# Altium schematic sheet SystemStatusBoard.SchDoc
size C
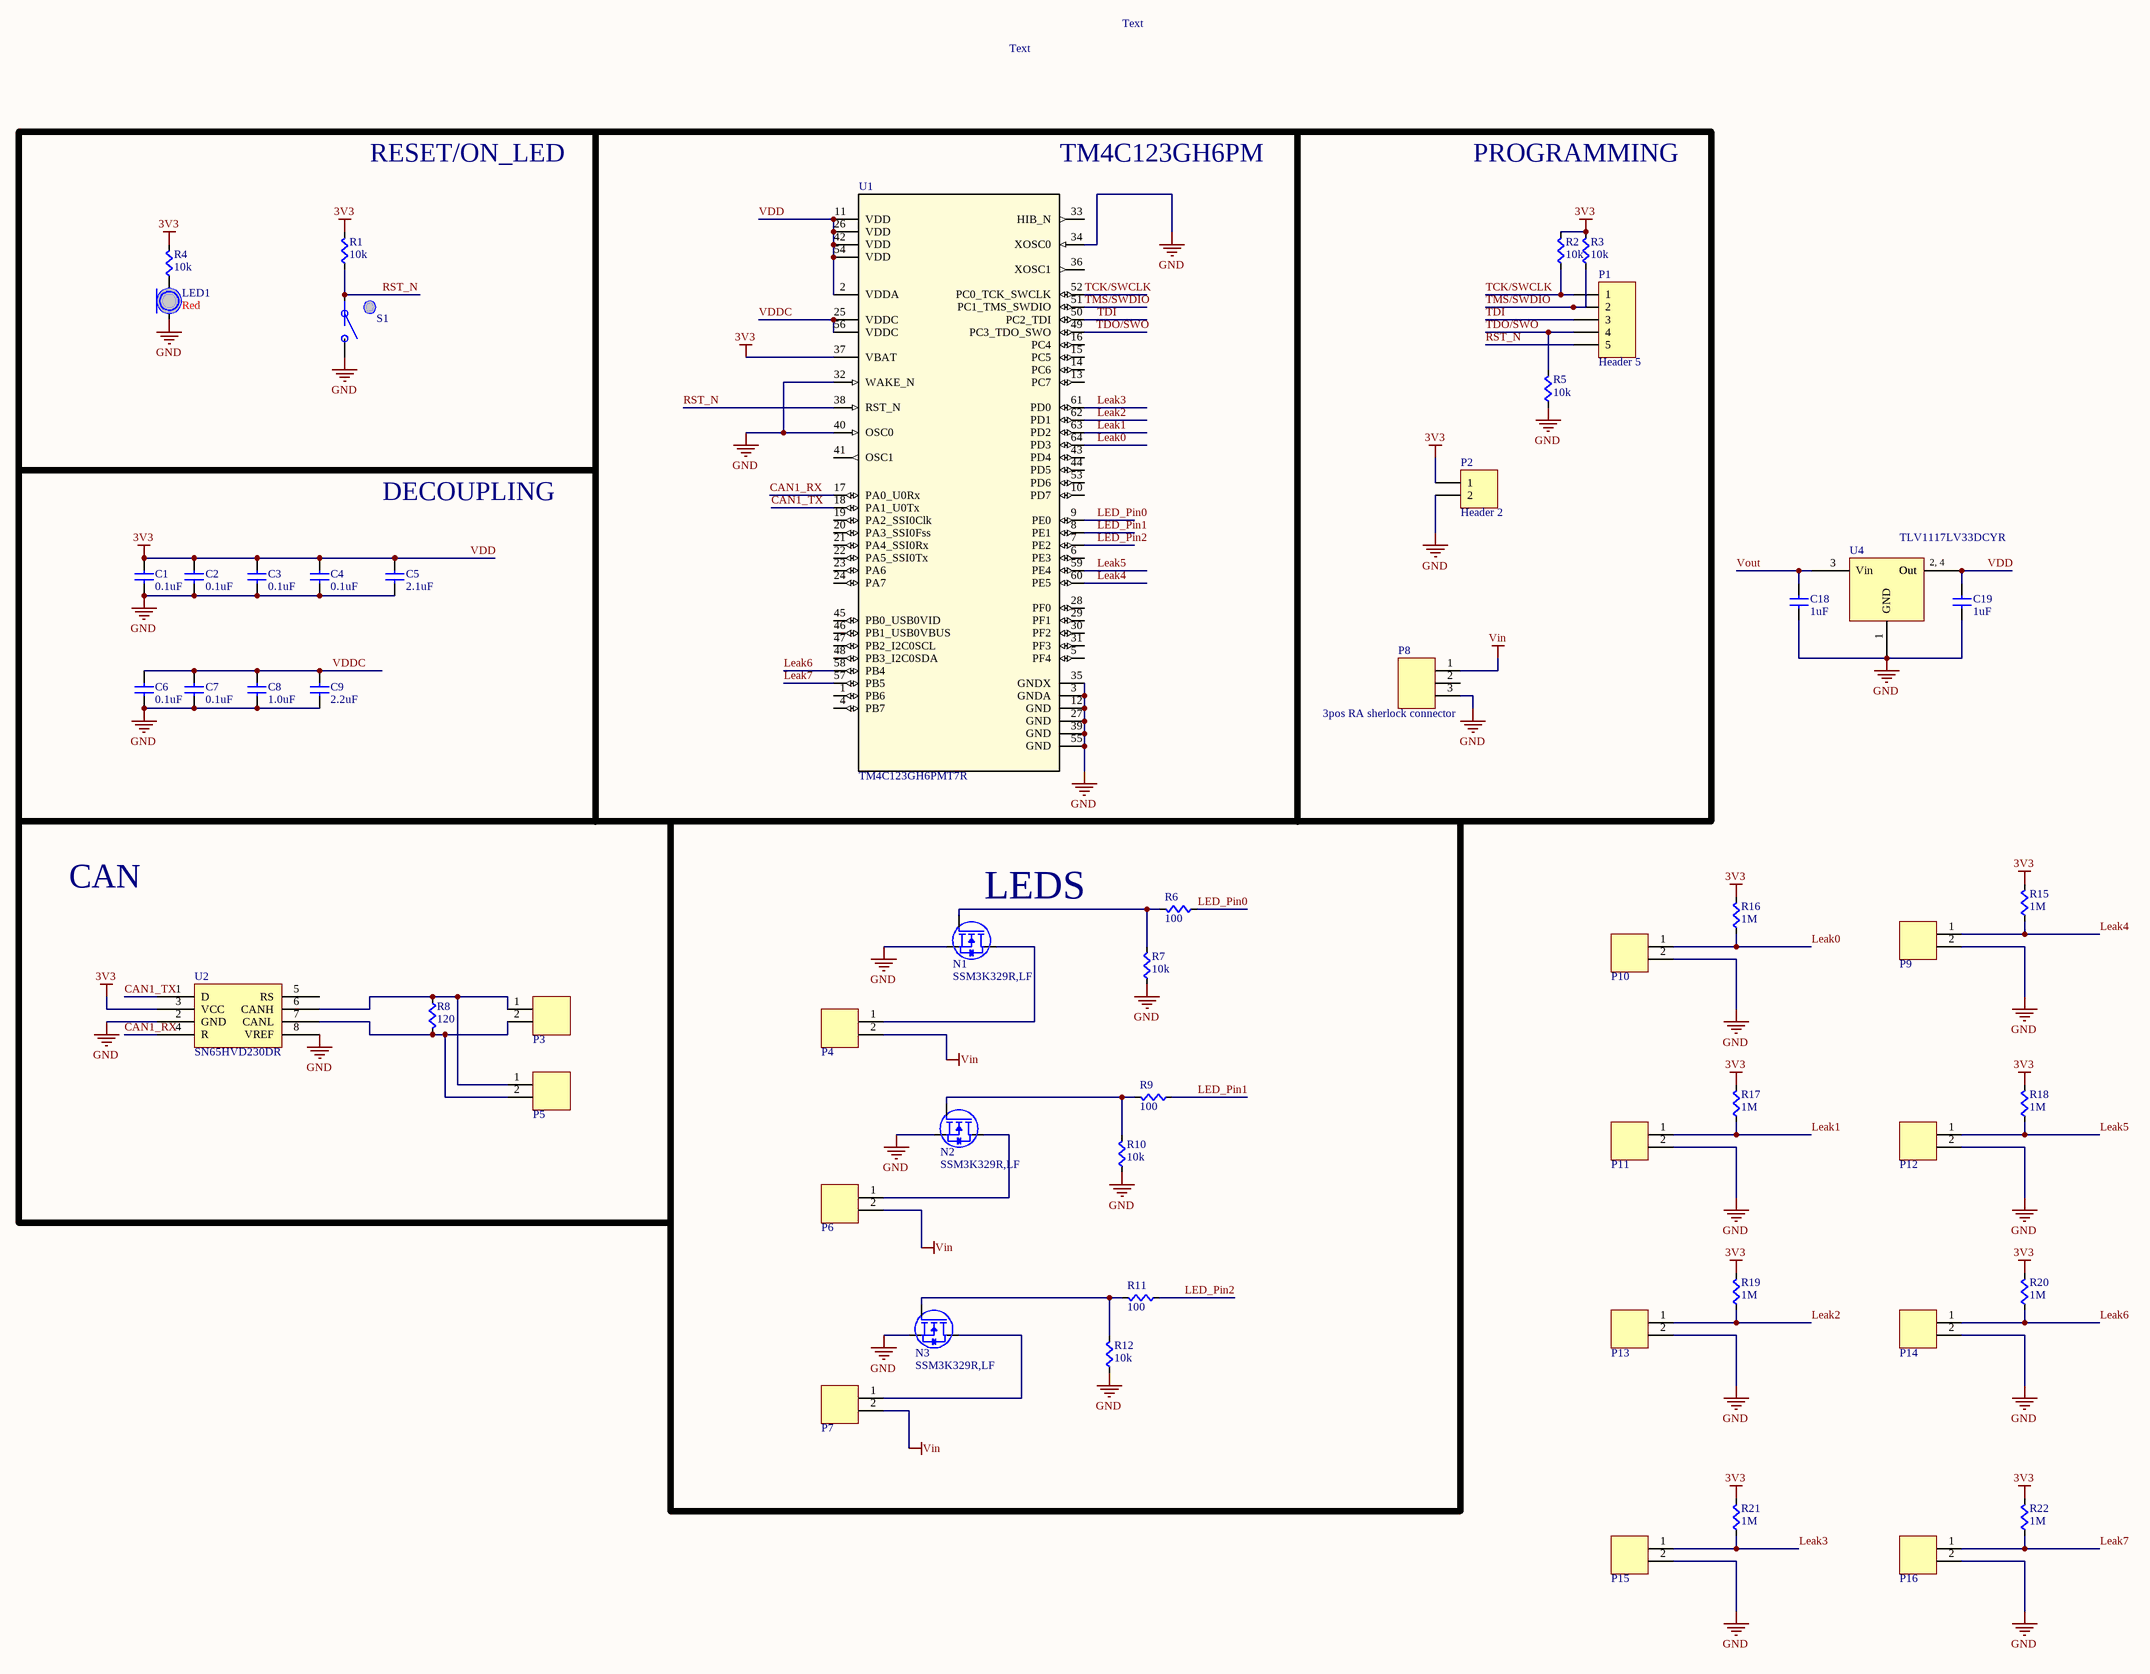
[diagram p0: SystemStatusBoard.SchDoc]

## Parts
C1  value 0.1uF  [CAPC0603]  (hidden comment: Cap)
C2  value 0.1uF  [CAPC0603]  (hidden comment: Cap)
C3  value 0.1uF  [CAPC0603]  (hidden comment: Cap)
C4  value 0.1uF  [CAPC0603]  (hidden comment: Cap)
C5  value 2.1uF  [CAPC0603]  (hidden comment: Cap)
C6  value 0.1uF  [CAPC0603]  (hidden comment: Cap)
C7  value 0.1uF  [CAPC0603]  (hidden comment: Cap)
C8  value 1.0uF  [CAPC0603]  (hidden comment: Cap)
C9  value 2.2uF  [CAPC0603]  (hidden comment: Cap)
C18  value 1uF  [CAPC0603]  (hidden comment: Cap)
C19  value 1uF  [CAPC0603]  (hidden comment: Cap)
LED1  Color: Red  [LED0603]  (hidden comment: LED)
N1  SSM3K329R,LF  [SSM3K329R,LF]
N2  SSM3K329R,LF  [SSM3K329R,LF]
N3  SSM3K329R,LF  [SSM3K329R,LF]
P1  Header 5  [HDR1X5]
P2  Header 2  [HDR1X2]
P3  2-pin Horz Sherlock  [MOLEX-HDR-1X2-SHERLOCK-HORZ]  (value not drawn)
P4  2-pin Vert Sherlock  [MOLEX-HDR-1X2-SHERLOCK-VERT]  (value not drawn)
P5  2-pin Horz Sherlock  [MOLEX-HDR-1X2-SHERLOCK-HORZ]  (value not drawn)
P6  2-pin Vert Sherlock  [MOLEX-HDR-1X2-SHERLOCK-VERT]  (value not drawn)
P7  2-pin Vert Sherlock  [MOLEX-HDR-1X2-SHERLOCK-VERT]  (value not drawn)
P8  3pos RA sherlock connector  [MOLEX-HDR-1X3-SHERLOCK-RA]
P9  2-pin Vert Sherlock  [MOLEX-HDR-1X2-SHERLOCK-VERT]  (value not drawn)
P10  2-pin Vert Sherlock  [MOLEX-HDR-1X2-SHERLOCK-VERT]  (value not drawn)
P11  2-pin Vert Sherlock  [MOLEX-HDR-1X2-SHERLOCK-VERT]  (value not drawn)
P12  2-pin Vert Sherlock  [MOLEX-HDR-1X2-SHERLOCK-VERT]  (value not drawn)
P13  2-pin Vert Sherlock  [MOLEX-HDR-1X2-SHERLOCK-VERT]  (value not drawn)
P14  2-pin Vert Sherlock  [MOLEX-HDR-1X2-SHERLOCK-VERT]  (value not drawn)
P15  2-pin Vert Sherlock  [MOLEX-HDR-1X2-SHERLOCK-VERT]  (value not drawn)
P16  2-pin Vert Sherlock  [MOLEX-HDR-1X2-SHERLOCK-VERT]  (value not drawn)
R1  value 10k  [RES0603]  (hidden comment: Res)
R2  value 10k  [RES0603]  (hidden comment: Res)
R3  value 10k  [RES0603]  (hidden comment: Res)
R4  value 10k  [RES0603]  (hidden comment: Res)
R5  value 10k  [RES0603]  (hidden comment: Res)
R6  value 100  [RES0603]  (hidden comment: Res)
R7  value 10k  [RES0603]  (hidden comment: Res)
R8  value 120  [RES0603]  (hidden comment: Res)
R9  value 100  [RES0603]  (hidden comment: Res)
R10  value 10k  [RES0603]  (hidden comment: Res)
R11  value 100  [RES0603]  (hidden comment: Res)
R12  value 10k  [RES0603]  (hidden comment: Res)
R15  value 1M  [RES0603]  (hidden comment: Res)
R16  value 1M  [RES0603]  (hidden comment: Res)
R17  value 1M  [RES0603]  (hidden comment: Res)
R18  value 1M  [RES0603]  (hidden comment: Res)
R19  value 1M  [RES0603]  (hidden comment: Res)
R20  value 1M  [RES0603]  (hidden comment: Res)
R21  value 1M  [RES0603]  (hidden comment: Res)
R22  value 1M  [RES0603]  (hidden comment: Res)
S1  Button  [PTS645xxxxSMTR92]  (value not drawn)
U1  TM4C123GH6PMT7R  [PM0064A_N]
U2  SN65HVD230DR  [SOIC-8pin]
U4  TLV1117LV33DCYR  [SOT23-4N]

## Blocks framed on the sheet
RESET/ON_LED: LED1 R1 R4 S1
TM4C123GH6PM: U1
PROGRAMMING: P1 P2 P8 R2 R3 R5
DECOUPLING: C1-C9
CAN: P3 P5 R8 U2
LEDS: N1-N3 P4 P6 P7 R6 R7 R9-R12

## Nets
GND: C1.2(B) C2.2(B) C3.2(B) C4.2(B) C5.2(B) C6.2(B) C7.2(B) C8.2(B) C9.2(B) C18.2(B) C19.2(B) LED1.C N1.2(S) N2.2(S) N3.2(S) P2.2 P8.3 P9.2 P10.2 P11.2 P12.2 P13.2 P14.2 P15.2 P16.2 R5.2(B) R7.2(B) R10.2(B) R12.2(B) S1.B U1.3(GNDA) U1.12(GND) U1.27(GND) U1.32(WAKE_N) U1.34(XOSC0) U1.35(GNDX) U1.39(GND) U1.40(OSC0) U1.55(GND) U2.2(GND) U2.8(VREF) U4.1(GND)
VDD: C1.1(A) C2.1(A) C3.1(A) C4.1(A) C5.1(A) C19.1(A) P2.1 R1.1(A) R2.1(A) R3.1(A) R4.1(A) R15.1(A) R16.1(A) R17.1(A) R18.1(A) R19.1(A) R20.1(A) R21.1(A) R22.1(A) U1.2(VDDA) U1.11(VDD) U1.26(VDD) U1.37(VBAT) U1.42(VDD) U1.54(VDD) U2.3(VCC) U4.2(Out) U4.4(Out)  [also labelled 3V3]
Vin: P4.2 P6.2 P7.2 P8.1
CAN1_RX: U1.17(PA0_U0Rx) U2.4(R)
CAN1_TX: U1.18(PA1_U0Tx) U2.1(D)
Leak0: P10.1 R16.2(B) U1.64(PD3)
Leak1: P11.1 R17.2(B) U1.63(PD2)
Leak2: P13.1 R19.2(B) U1.62(PD1)
Leak3: P15.1 R21.2(B) U1.61(PD0)
Leak4: P9.1 R15.2(B) U1.60(PE5)
Leak5: P12.1 R18.2(B) U1.59(PE4)
Leak6: P14.1 R20.2(B) U1.58(PB4)
Leak7: P16.1 R22.2(B) U1.57(PB5)
LED_Pin0: R6.2(B) U1.9(PE0)
LED_Pin1: R9.2(B) U1.8(PE1)
LED_Pin2: R11.2(B) U1.7(PE2)
RST_N: P1.5 R1.2(B) S1.A U1.38(RST_N)
TCK/SWCLK: P1.1 R2.2(B) U1.52(PC0_TCK_SWCLK)
TDI: P1.3 U1.50(PC2_TDI)
TDO/SWO: P1.4 R5.1(A) U1.49(PC3_TDO_SWO)
TMS/SWDIO: P1.2 R3.2(B) U1.51(PC1_TMS_SWDIO)
VDDC: C6.1(A) C7.1(A) C8.1(A) C9.1(A) U1.25(VDDC) U1.56(VDDC)
Vout: C18.1(A) U4.3(Vin)
NetLED1_A: LED1.A R4.2(B)
NetN1_1: N1.1(G) R6.1(A) R7.1(A)
NetN1_3: N1.3(D) P4.1
NetN2_1: N2.1(G) R9.1(A) R10.1(A)
NetN2_3: N2.3(D) P6.1
NetN3_1: N3.1(G) R11.1(A) R12.1(A)
NetN3_3: N3.3(D) P7.1
NetP3_1: P3.1 P5.1 R8.2(B) U2.6(CANH)
NetP3_2: P3.2 P5.2 R8.1(A) U2.7(CANL)

Not connected (* = marked no-connect by the designer): P8 2; U1 1(PB6) 4(PB7) 5(PF4) 6(PE3) 10(PD7) 13(PC7) 14(PC6) 15(PC5) 16(PC4) 19(PA2_SSI0Clk) 20(PA3_SSI0Fss) 21(PA4_SSI0Rx) 22(PA5_SSI0Tx) 23(PA6) 24(PA7) 28(PF0) 29(PF1) 30(PF2) 31(PF3) 33(HIB_N) 36(XOSC1) 41(OSC1) 43(PD4) 44(PD5) 45(PB0_USB0VID) 46(PB1_USB0VBUS) 47(PB2_I2C0SCL) 48(PB3_I2C0SDA) 53(PD6); U2 5(RS)

## Notes on the sheet
- Text
- (in symbol TLV1117LV33DCYR) 2, 4

## Library data of the parts
C18 C19 = Cap: Manufacturer Part Number: C0603C105K8PACTU; Supplier 1: Digi-Key; Supplier Part Number 1: 399-3118-1-ND
N1-N3 = SSM3K329R,LF: MOSFET N CH 30V 3.5A 2-3Z1A; Manufacturer 1: Toshiba Semiconductor and Storage; Supplier 1: Digi-Key; Supplier Part Number 1: SSM3K329RLFTR-ND; Manufacturer Part Number 1: SSM3K329R,LF
P1 = Header 5: Header, 5-Pin; LatestRevisionDate: 17-Jul-2002; LatestRevisionNote: Re-released for DXP Platform.; Publisher: Altium Limited
P2 = Header 2: Header, 2-Pin; LatestRevisionDate: 17-Jul-2002; LatestRevisionNote: Re-released for DXP Platform.; Publisher: Altium Limited
P3 P5 = MOLEX-HDR-1x2-SHERLOCK_RA: Header, Molex, 2mm Pitch Sherlock Header, Single Row, Horizontal, 2 Circuits, Length 3.3mm,  0353630260; Manufacturer: Molex Inc; Manufacturer Part Number: 0353630260; Supplier Part Number 1: WM18931-ND; Supplier 1: Digi-Key
P4 P6 P7 P9-P16 = MOLEX-HDR-1x2-SHERLOCK_VERT: Header, Molex, 2mm Pitch Sherlock Header, Single Row, Vertical, 2 Circuits, Length 3.3mm, 0353620250; Manufacturer Part Number: *; Order Part Number: *
P8 = MOLEX-HDR-1x3-SHERLOCK_RA: Header, Molex, 2mm Pitch Sherlock Header, Single Row, Right Angle 3 Circuits, Length 3.3mm; Manufacturer Part Number: 35363-0360; Manufacturer: Molex Connector Corporation; Supplier Part Number 1: WM18932-ND; Supplier 1: Digi-Key
S1 = Button: SPST Button; Supplier 1: Digi-Key; Supplier Part Number 1: CKN9087CT-ND
U1 = TM4C123GH6PMT7R: Imported; PartNumber: TM4C123GH6PMTR; Manufacturer: Texas Instruments; CompType: IC; PIN_COUNT: 64; Application_BuildNumber: *; Alternate_PartNumber: TM4C123GH6PMT; PackageReference: PM0064A; MountType: SMT; RoHS: Y; RefDes: RefDes; TYPE: TYPE; Value: Value
U2 = SN65HVD230DR: IC TXRX CAN 1MBPS 3.3V 8SOIC; Supplier 1: Digi-Key; Supplier Part Numbe 1: 296-11654-1-ND
U4 = TLV1117LV33DCYR: IC REG LINEAR 3.3V 1A SOT223-4; Digi-Key Part Number: 296-28778-1-ND
C1-C9 = Cap: Supplier 1: Digi-Key; Supplier Part Number 1: 1276-1000-1-ND
LED1 = LED: Supplier 1: Digi-Key; Supplier Part Number 1: 754-1122-1-ND
R1-R12 R15-R22 = Res: Supplier 1: Digi-Key; Supplier Part Number 1: RMCF0603JT10K0CT-ND